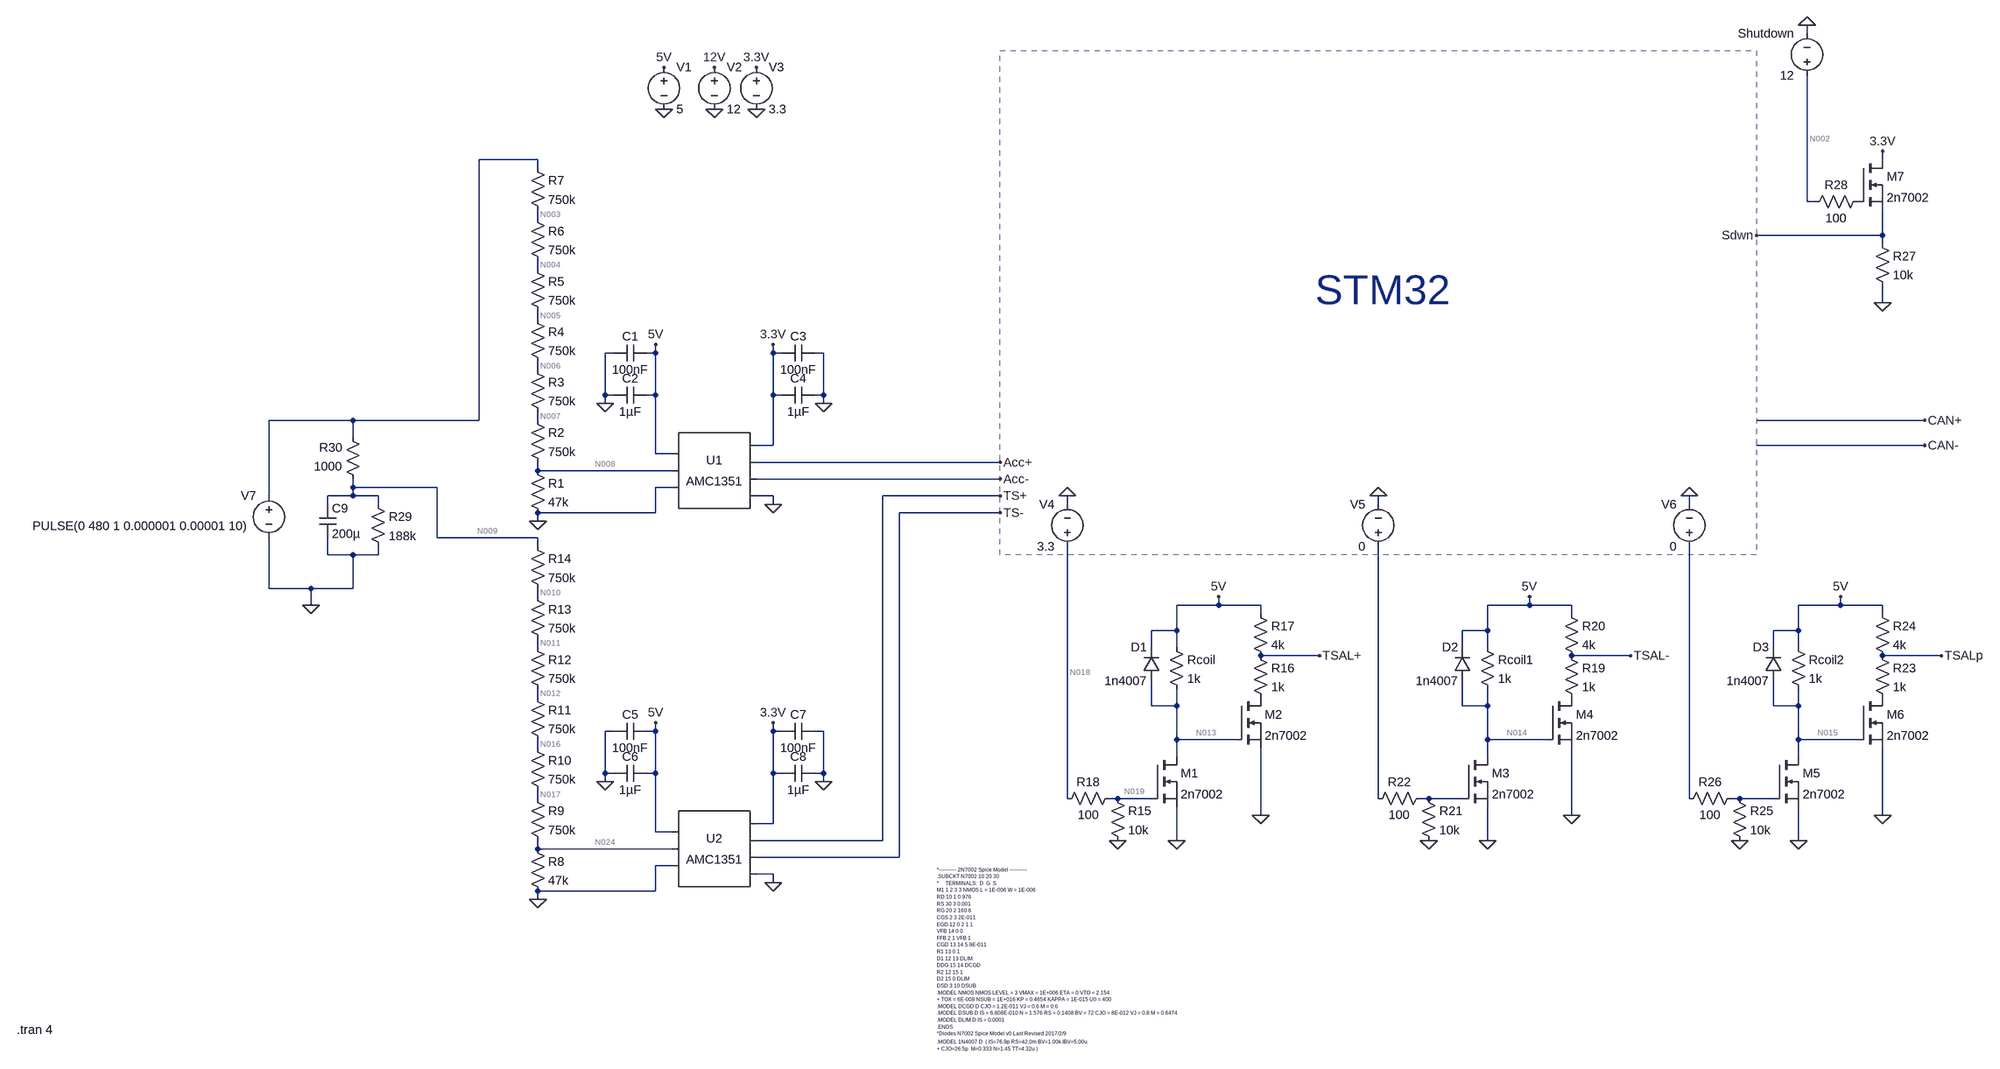
[diagram p0: schematic Precharge complete.asc]
* Precharge complete.asc
* U1: AMC1351 (symbol AutoGenerated\AMC1351 not available, pins judged from their places): pin1=5V pin2=N008 pin3=0 pin4=3.3V pin5=Acc+ pin6=Acc- pin7=0
V1 5V 0 5
V2 12V 0 12
V3 3.3V 0 3.3
C1 5V 0 100nF
C2 5V 0 1µF
R1 N008 0 47k
R2 N007 N008 750k
R3 N006 N007 750k
R4 N005 N006 750k
R5 N004 N005 750k
R6 N003 N004 750k
R7 N001 N003 750k
C3 3.3V 0 100nF
C4 3.3V 0 1µF
* U2: AMC1351 (symbol AutoGenerated\AMC1351 not available, pins judged from their places): pin1=5V pin2=N024 pin3=0 pin4=3.3V pin5=TS+ pin6=TS- pin7=0
C5 5V 0 100nF
C6 5V 0 1µF
R8 N024 0 47k
R9 N017 N024 750k
R10 N016 N017 750k
R11 N012 N016 750k
R12 N011 N012 750k
R13 N010 N011 750k
R14 N009 N010 750k
C7 3.3V 0 100nF
C8 3.3V 0 1µF
M1 N013 N019 0 0 2n7002
Rcoil 5V N013 1k
D1 N013 5V 1n4007
M2 P001 N013 0 0 2n7002
R16 TSAL+ P001 1k
R17 5V TSAL+ 4k
R15 N019 0 10k
R18 N019 N018 100
M3 N014 N021 0 0 2n7002
Rcoil1 5V N014 1k
D2 N014 5V 1n4007
M4 P002 N014 0 0 2n7002
R19 TSAL- P002 1k
R20 5V TSAL- 4k
R21 N021 0 10k
R22 N021 N020 100
M5 N015 N023 0 0 2n7002
Rcoil2 5V N015 1k
D3 N015 5V 1n4007
M6 P003 N015 0 0 2n7002
R23 TSALp P003 1k
R24 5V TSALp 4k
R25 N023 0 10k
R26 N023 N022 100
M7 3.3V P004 Sdwn Sdwn 2n7002
R27 Sdwn 0 10k
R28 P004 N002 100
V4 N018 0 3.3
V5 N020 0 0
V6 N022 0 0
V§Shutdown N002 0 12
C9 N009 0 200µ
R29 N009 0 188k
V7 N001 0 PULSE(0 480 1 0.000001 0.00001 10)
R30 N009 N001 1000
.model D D
.lib standard.dio
.model NMOS NMOS
.model PMOS PMOS
.lib standard.mos
*---------- 2N7002 Spice Model ----------
.SUBCKT N7002 10 20 30
*     TERMINALS:  D  G  S
M1 1 2 3 3 NMOS L = 1E-006 W = 1E-006
RD 10 1 0.976
RS 30 3 0.001
RG 20 2 160.6
CGS 2 3 2E-011
EGD 12 0 2 1 1
VFB 14 0 0
FFB 2 1 VFB 1
CGD 13 14 5.9E-011
R1 13 0 1
D1 12 13 DLIM
DDG 15 14 DCGD
R2 12 15 1
D2 15 0 DLIM
DSD 3 10 DSUB
.MODEL NMOS NMOS LEVEL = 3 VMAX = 1E+006 ETA = 0 VTO = 2.154
+ TOX = 6E-008 NSUB = 1E+016 KP = 0.4654 KAPPA = 1E-015 U0 = 400
.MODEL DCGD D CJO = 1.2E-011 VJ = 0.6 M = 0.6
.MODEL DSUB D IS = 6.808E-010 N = 1.576 RS = 0.1408 BV = 72 CJO = 8E-012 VJ = 0.8 M = 0.6474
.MODEL DLIM D IS = 0.0001
.ENDS
*Diodes N7002 Spice Model v0 Last Revised 2017/2/9
* STM32
.tran 4
.MODEL 1N4007 D  ( IS=76.9p RS=42.0m BV=1.00k IBV=5.00u
+ CJO=26.5p  M=0.333 N=1.45 TT=4.32u )
.backanno
.end

* Results of the author's LTspice run, read from the files saved beside the schematic
* Operating Point, zero values left out:
*   V(3.3v) = 3.3 V
*   V(acc+) = 1.44 V
*   V(acc-) = 1.44 V
*   V(5v) = 5 V
*   V(n008) = 154.3 µV
*   V(12v) = 12 V
*   V(n007) = 128.6 µV
*   V(n006) = 102.8 µV
*   V(n005) = 77.13 µV
*   V(n004) = 51.42 µV
*   V(n003) = 25.71 µV
*   V(ts+) = 1.44 V
*   V(ts-) = 1.44 V
*   V(n024) = 154.3 µV
*   V(n017) = 128.6 µV
*   V(n016) = 102.9 µV
*   V(n012) = 77.15 µV
*   V(n011) = 51.44 µV
*   V(n010) = 25.74 µV
*   V(n009) = 34.09 nV
*   V(n013) = 17.91 mV
*   V(n019) = 3.267 V
*   V(p001) = 5 V
*   V(tsal+) = 5 V
*   V(n018) = 3.3 V
*   V(n014) = 5 V
*   V(p002) = 2.134 mV
*   V(tsal-) = 1.002 V
*   V(n015) = 5 V
*   V(p003) = 2.134 mV
*   V(tsalp) = 1.002 V
*   V(p004) = 12 V
*   V(sdwn) = 3.3 V
*   V(n002) = 12 V
*   Id(M7) = 330 µA
*   Is(M7) = -330 µA
*   Id(M6) = 999.6 µA
*   Is(M6) = -999.6 µA
*   Id(M5) = 5.031 pA
*   Is(M5) = -5.031 pA
*   Id(M4) = 999.6 µA
*   Is(M4) = -999.6 µA
*   Id(M3) = 5.031 pA
*   Is(M3) = -5.031 pA
*   Id(M2) = 5.031 pA
*   Is(M2) = -5.031 pA
*   Id(M1) = 4.982 mA
*   Is(M1) = -4.982 mA
*   I(D1) = -81.88 pA
*   I(R30) = 34.09 pA
*   I(R27) = 330 µA
*   I(R24) = 999.6 µA
*   I(R23) = 999.6 µA
*   I(Rcoil2) = 10.02 pA
*   I(R20) = 999.6 µA
*   I(R19) = 999.6 µA
*   I(Rcoil1) = 10.02 pA
*   I(R18) = -326.7 µA
*   I(R15) = 326.7 µA
*   I(R17) = 10.04 pA
*   I(R16) = 10.04 pA
*   I(Rcoil) = 4.982 mA
*   I(R14) = -34.27 pA
*   I(R13) = -34.27 pA
*   I(R12) = -34.27 pA
*   I(R11) = -34.27 pA
*   I(R10) = -34.27 pA
*   I(R9) = -34.27 pA
*   I(R8) = 3.282 nA
*   I(R7) = -34.28 pA
*   I(R6) = -34.28 pA
*   I(R5) = -34.28 pA
*   I(R4) = -34.28 pA
*   I(R3) = -34.28 pA
*   I(R2) = -34.28 pA
*   I(R1) = 3.282 nA
*   I(V7) = 68.37 pA
*   I(V4) = -326.7 µA
*   I(V3) = -11.13 mA
*   I(V1) = -21.25 mA
*   Ix(u1:VDD1) = 7.134 mA
*   Ix(u1:IN) = -3.317 nA
*   Ix(u1:GND1) = -7.134 mA
*   Ix(u1:GND2) = -5.402 mA
*   Ix(u1:VDD2) = 5.402 mA
*   Ix(u2:VDD1) = 7.134 mA
*   Ix(u2:IN) = -3.317 nA
*   Ix(u2:GND1) = -7.134 mA
*   Ix(u2:GND2) = -5.402 mA
*   Ix(u2:VDD2) = 5.402 mA
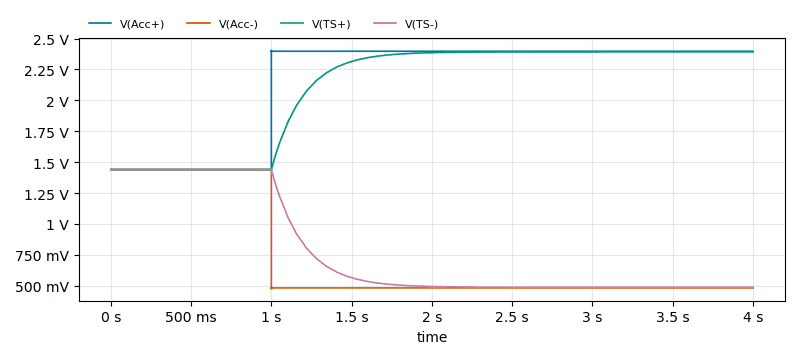
[diagram p1: Transient Analysis of Precharge complete.asc, plotted from the saved traces]
* Transient Analysis, 1 run:
*   V(Acc+): min 1.44 V, max 2.405 V, average 2.158 V, rms 2.198 V, last 2.397 V
*   V(Acc-): min 475.6 mV, max 1.44 V, average 722.1 mV, rms 832.6 mV, last 482.8 mV
*   V(TS+): min 1.44 V, max 2.392 V, average 2.107 V, rms 2.146 V, last 2.392 V
*   V(TS-): min 488.1 mV, max 1.44 V, average 773.6 mV, rms 875.4 mV, last 488.1 mV